# EAGLE schematic wo_liu_tan_shang2 (EAGLE 9.3.0)
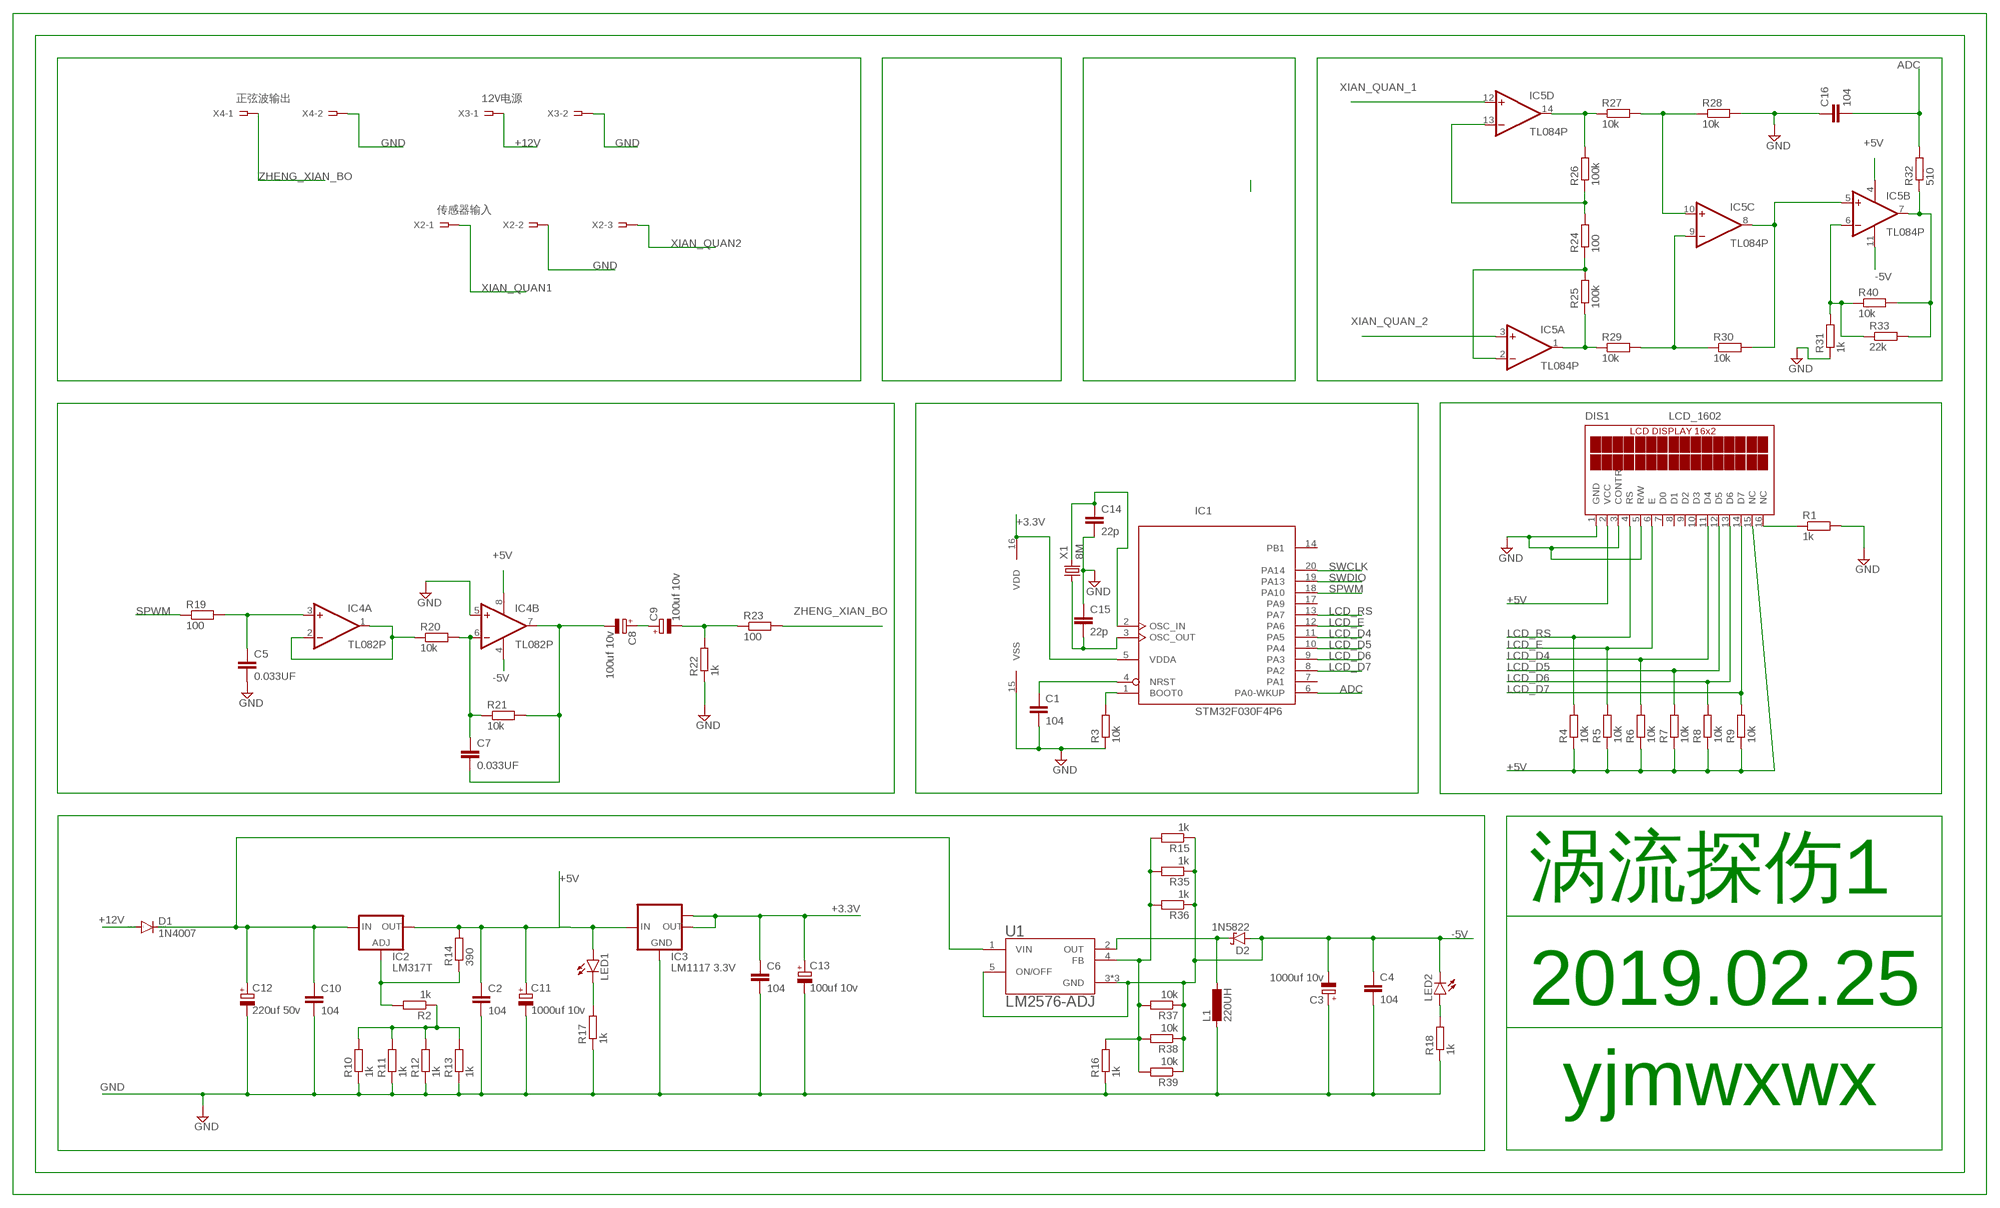
[diagram p0: schematic, sheet 1]

## Parts
C1  104  C2,5-3  [C2.5-3]
C2  104  C2,5-3  [C2.5-3]
C3  1000uf 10v  CPOL-EUE1.8-4  [E1,8-4]
C4  104  C2,5-3  [C2.5-3]
C5  0.033UF  C2,5-3  [C2.5-3]
C6  104  C2,5-3  [C2.5-3]
C7  0.033UF  C2,5-3  [C2.5-3]
C8  100uf 10v  CPOL-EUE1.8-4  [E1,8-4]
C9  100uf 10v  CPOL-EUE1.8-4  [E1,8-4]
C10  104  C2,5-3  [C2.5-3]
C11  1000uf 10v  CPOL-EUE1.8-4  [E1,8-4]
C12  220uf 50v  CPOL-EUE1.8-4  [E1,8-4]
C13  100uf 10v  CPOL-EUE1.8-4  [E1,8-4]
C14  22p  C2,5-3  [C2.5-3]
C15  22p  C2,5-3  [C2.5-3]
C16  104  C2,5-3  [C2.5-3]
D1  1N4007  1N4004  [DO41-10]
D2  1N5822  1N5819-T  [DO41-7.6]
DIS1  LCD_1602  TUXGR_16X2_R2  [TUXGR_16X2_R2]
IC1  STM32F030F4P6  STM32F030F4P  [TSSOP20-I]
IC2  LM317T  LM317TS  [317TS]
IC3  LM1117 3.3V  LM1117IMPX-3.3  [SOT223]
IC4  TL082P  [DIL08]
IC5  TL084P  [DIL14]
L1  220UH  L-EU6000-XXX-RC  [6000-XXXX-RC]
LED1  LED5MM  [LED5MM]
LED2  LED5MM  [LED5MM]
R1  1k  R-EU_0204/5  [0204/5]
R2  1k  R-EU_0204/5  [0204/5]
R3  10k  R-EU_0204/5  [0204/5]
R4  10k  R-EU_0204/5  [0204/5]
R5  10k  R-EU_0204/5  [0204/5]
R6  10k  R-EU_0204/5  [0204/5]
R7  10k  R-EU_0204/5  [0204/5]
R8  10k  R-EU_0204/5  [0204/5]
R9  10k  R-EU_0204/5  [0204/5]
R10  1k  R-EU_0204/5  [0204/5]
R11  1k  R-EU_0204/5  [0204/5]
R12  1k  R-EU_0204/5  [0204/5]
R13  1k  R-EU_0204/5  [0204/5]
R14  390  R-EU_0204/5  [0204/5]
R15  1k  R-EU_0204/5  [0204/5]
R16  1k  R-EU_0204/5  [0204/5]
R17  1k  R-EU_0204/5  [0204/5]
R18  1k  R-EU_0204/5  [0204/5]
R19  100  R-EU_0204/5  [0204/5]
R20  10k  R-EU_0204/5  [0204/5]
R21  10k  R-EU_0204/5  [0204/5]
R22  1k  R-EU_0204/5  [0204/5]
R23  100  R-EU_0204/5  [0204/5]
R24  100  R-EU_0204/5  [0204/5]
R25  100k  R-EU_0204/5  [0204/5]
R26  100k  R-EU_0204/5  [0204/5]
R27  10k  R-EU_0204/5  [0204/5]
R28  10k  R-EU_0204/5  [0204/5]
R29  10k  R-EU_0204/5  [0204/5]
R30  10k  R-EU_0204/5  [0204/5]
R31  1k  R-EU_0204/5  [0204/5]
R32  510  R-EU_0204/5  [0204/5]
R33  22k  R-EU_0204/5  [0204/5]
R35  1k  R-EU_0204/5  [0204/5]
R36  1k  R-EU_0204/5  [0204/5]
R37  10k  R-EU_0204/5  [0204/5]
R38  10k  R-EU_0204/5  [0204/5]
R39  10k  R-EU_0204/5  [0204/5]
R40  10k  R-EU_0204/5  [0204/5]
U1  LM2576-ADJ  LM2576HVS-ADJ/NOPB  [REG_LM2576HVS-ADJ/NOPB]
X1  8M  CRYSTALS-NOGND-HC49/4H  [HC49]
X2  传感器输入  SSW-101-02-G-T  [SSW-101-02-G-T]
X3  12V电源  SSW-101-02-G-D  [SSW-101-02-G-D]
X4  正弦波输出  SSW-101-02-G-D  [SSW-101-02-G-D]

## Nets
+3.3V: C6.1 C13.+ IC1.5(VDDA) IC1.16(VDD) IC3.2(OUT) IC3.TAB(OUT1)
+5V: C2.1 C11.+ DIS1.2(VCC) DIS1.15(NC) IC2.2(OUT) IC3.3(IN) IC4.8(P:V+) IC5.4(P:V+) LED1.A R4.1 R5.1 R6.1 R7.1 R8.1 R9.1 R14.2
+12V: D1.A X3.1
-5V: C3.- C4.1 D2.A IC4.4(P:V-) IC5.11(P:V-) LED2.K(C) R15.1 R35.1 R36.1 R37.1 R38.1 R39.1 U1.3(GND) U1.5(ON/OFF) U1.6(GND) U1.7(GND)
ADC: C16.2 IC1.6(PA0-WKUP) R32.2
GND: C1.2 C2.2 C3.+ C4.2 C5.2 C6.2 C10.2 C11.- C12.- C13.- C14.2 C15.1 C16.1 DIS1.1(GND) DIS1.3(CONTR) DIS1.5(R/W) IC1.15(VSS) IC3.1(GND) IC4.5(B:+IN) L1.2 R1.2 R3.1 R10.1 R11.1 R12.1 R13.1 R16.1 R17.1 R18.1 R22.1 R28.2 R31.1 X2.2 X3.2 X4.2
LCD_D4: DIS1.11(D4) IC1.11(PA5) R6.2
LCD_D5: DIS1.12(D5) IC1.10(PA4) R7.2
LCD_D6: DIS1.13(D6) IC1.9(PA3) R8.2
LCD_D7: DIS1.14(D7) IC1.8(PA2) R9.2
LCD_E: DIS1.6(E) IC1.12(PA6) R5.2
LCD_RS: DIS1.4(RS) IC1.13(PA7) R4.2
N$3: R2.1 R10.2 R11.2 R12.2 R13.2
N$4: IC1.1(BOOT0) R3.2
N$5: IC2.1(ADJ) R2.2 R14.1
N$6: C1.1 IC1.4(NRST)
N$7: DIS1.16(NC) R1.1
N$8: IC4.1(A:OUT) IC4.2(A:-IN) R20.1
N$11: C5.1 IC4.3(A:+IN) R19.2
N$12: C10.1 C12.+ D1.C IC2.3(IN) U1.1(VIN)
N$13: IC5.2(A:-IN) R24.1 R25.2
N$14: D2.C L1.1 U1.2(OUT)
N$15: C7.1 IC4.6(B:-IN) R20.2 R21.1
N$17: LED1.K(C) R17.2
N$18: C7.2 C8.- IC4.7(B:OUT) R21.2
N$19: LED2.A R18.2
N$20: C8.+ C9.+
N$21: C9.- R22.2 R23.1
N$22: IC5.14(D:OUT) R26.2 R27.1
N$23: IC5.1(A:OUT) R25.1 R29.1
N$24: IC5.6(B:-IN) R31.2 R33.1 R40.1
N$25: IC5.13(D:-IN) R24.2 R26.1
N$26: IC5.10(C:+IN) R27.2 R28.1
N$27: IC5.9(C:-IN) R29.2 R30.1
N$29: IC5.7(B:OUT) R32.1 R33.2 R40.2
N$34: C15.2 IC1.3(OSC_OUT) X1.1
N$35: C14.1 IC1.2(OSC_IN) X1.2
N$42: R15.2 R16.2 R35.2 R36.2 R37.2 R38.2 R39.2 U1.4(FB)
N$43: IC5.5(B:+IN) IC5.8(C:OUT) R30.2
SPWM: IC1.18(PA10) R19.1
SWCLK: IC1.20(PA14)
SWDIO: IC1.19(PA13)
XIAN_QUAN1: X2.1
XIAN_QUAN2: X2.3
XIAN_QUAN_1: IC5.12(D:+IN)
XIAN_QUAN_2: IC5.3(A:+IN)
ZHENG_XIAN_BO: R23.2 X4.1
Unconnected: DIS1.7(D0) DIS1.8(D1) DIS1.9(D2) DIS1.10(D3) IC1.7(PA1) IC1.14(PB1) IC1.17(PA9)

## Notes on the sheet
- 涡流探伤1
- 2019.02.25
- yjmwxwx

## Library data of the parts
C1 C2 C4-C7 C10 C14-C16 = capacitor-wima:C: CAPACITOR naming: grid - package width
C3 C8 C9 C11-C13 = rcl:CPOL-EU: POLARIZED CAPACITOR, European symbol; SPICEPREFIX: C
D1 = diode:1N4004: DIODE general purpose rectifier, 1 A
D2 = diode:1N581*: 1.0A SCHOTTKY BARRIER RECTIFIER Source: http://www.diodes.com/datasheets/ds23001.pdf
DIS1 = display-lcd:TUXGR_16X2_R2: Tuxgraphics LCD display 16x2 characters reflective, without background light Source: tuxgr_12x2_r2.pdf; OC_FARNELL: unknown; OC_NEWARK: unknown
IC1 = micro-stm_v3:STM32F030F*P: ARM 32-bit Cortex™-M0 CPU 48 MHz maximum frequency 16 Kbytes of Flash memory 4 kbytes of SRAM 15 GPIOs 2.4 to 3.6 V application supply
IC2 = v-reg:LM317TS: VOLTAGE REGULATOR
IC3 = lm1117:LM1117IMPX-*
IC4 = linear:TL082: OP AMP Data sheet <http://www.ti.com/lit/ds/symlink/tl084a . pdf>; DATA_SHEET: <a href="http://www.ti.com/lit/ds/symlink/tl084a.pdf"> Data sheet </a>
IC5 = linear:TL084: OP AMP
L1 = rcl:L-EU: INDUCTOR, European symbol; SPICEPREFIX: L
LED1 LED2 = led:LED: LED OSRAM: - CHIPLED LG R971, LG N971, LY N971, LG Q971, LY Q971, LO R971, LY R971 LH N974, LH R974 LS Q976, LO Q976, LY Q976 LO Q996 - Hyper CHIPLED LW Q18S LB Q993, LB Q99A, LB R99A - SideLED LS A670, LO A670, LY A670, LG A670, LP A670 LB A673, LV A673, LT A673, LW A673 LH A674 LY A675 LS A676, LA A676, LO A676, LY A676, LW A676 LS A679, LY A679, LG A679 - Hyper Micro SIDELED® LS Y876, LA Y876, LO Y876, LY Y876 LT Y87S - SmartLED LW L88C, LW L88S LB L89C, LB L89S, LG L890 LS L89K, LO L89K, LY L89K LS L896, LA L896, LO L896, LY L896 - TOPLED LS T670, LO T670, LY T670, LG T670, LP T670 LSG T670, LSP T670, LSY T670, LOP T670, LYG T670 LG T671, LOG T671, LSG T671 LB T673, LV T673, LT T673, LW T673 LH T674 LS T676, LA T676, LO T676, LY T676, LB T676, LH T676, LSB T676, LW T676 LB T67C, LV T67C, LT T67C, LS T67K, LO T67K, LY T67K, LW E67C LS E67B, LA E67B, LO E67B, LY E67B, LB E67C, LV E67C, LT E67C LW T67C LS T679, LY T679, LG T679 LS T770, LO T770, LY T770, LG T770, LP T770 LB T773, LV T773, LT T773, LW T773 LH T774 LS E675, LA E675, LY E675, LS T675 LS T776, LA T776, LO T776, LY T776, LB T776 LHGB T686 LT T68C, LB T68C - Hyper Mini TOPLED® LB M676 - Mini TOPLED Santana® LG M470 LS M47K, LO M47K, LY M47K Source: http://www.osram.convergy.de LUXEON: - LUMILED® LXK2-PW12-R00, LXK2-PW12-S00, LXK2-PW14-U00, LXK2-PW14-V00 LXK2-PM12-R00, LXK2-PM12-S00, LXK2-PM14-U00 LXK2-PE12-Q00, LXK2-PE12-R00, LXK2-PE12-S00, LXK2-PE14-T00, LXK2-PE14-U00 LXK2-PB12-K00, LXK2-PB12-L00, LXK2-PB12-M00, LXK2-PB14-N00, LXK2-PB14-P00, LXK2-PB14-Q00 LXK2-PR12-L00, LXK2-PR12-M00, LXK2-PR14-Q00, LXK2-PR14-R00 LXK2-PD12-Q00, LXK2-PD12-R00, LXK2-PD12-S00 LXK2-PH12-R00, LXK2-PH12-S00 LXK2-PL12-P00, LXK2-PL12-Q00, LXK2-PL12-R00 Source: www.luxeon.com KINGBRIGHT: KA-3528ASYC Source: www.kingbright.com
R1-R33 R35-R40 = rcl:R-EU_: RESISTOR, European symbol; SPICEPREFIX: R
U1 = LM2576HVS-ADJ_NOPB:LM2576HVS-ADJ/NOPB: IC REG BUCK ADJ 3A DDPAK; AVAILABILITY: Unavailable; DESCRIPTION: 简单的开关？4V至60V，3A低组件数降压稳压器5-DDPAK / TO-263 -40至125; MF: Texas Instruments; MP: LM2576HVS-ADJ/NOPB; PACKAGE: TO-263-5 Texas Instruments; PRICE: None
X1 = IQD-Frequency-Products:CRYSTALS-NOGND: CRYSTALS CAN NOT GROUNDED
X2 = con-samtec:SSW-101-02-G-T: THROUGH-HOLE .025" SQ POST SOCKET Source: Samtec SSW.pdf; MF: Samtec Inc.; MPN: SSW-101-02-G-T; OC_FARNELL: unknown; OC_NEWARK: 82P1460
X3 X4 = con-samtec:SSW-101-02-G: THROUGH-HOLE .025" SQ POST SOCKET Source: Samtec SSW.pdf; MF: Samtec Inc.; MPN: SSW-101-02-G-D; OC_FARNELL: unknown; OC_NEWARK: 82P1456